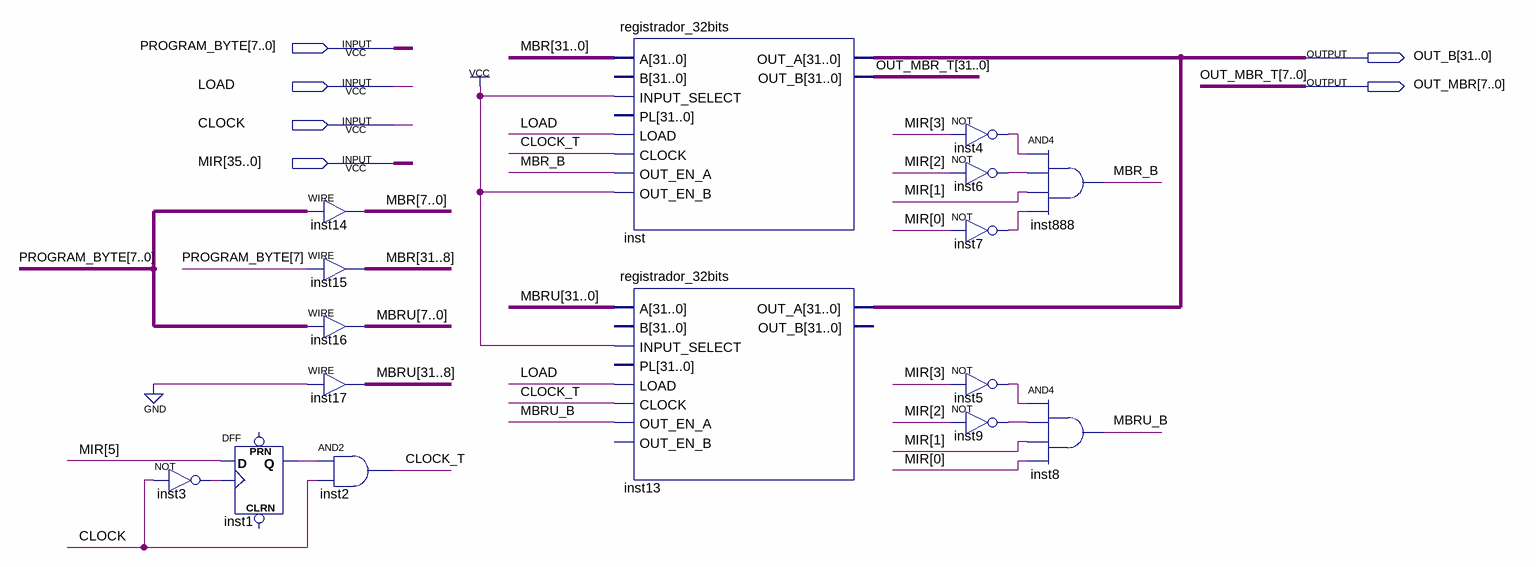
[diagram p0: schematic sheet]
// Quartus schematic MBR.bdf as structural Verilog: 16 symbols, 6 pins
module MBR (
  input  [7:0] PROGRAM_BYTE,
  input  LOAD,
  input  CLOCK,
  input  [35:0] MIR,
  output [31:0] OUT_B,
  output [7:0] OUT_MBR
);

  wire CLOCK_T, inst1_q, inst3_out, inst4_out, inst5_out, inst6_out, inst7_out, inst9_out, MBR_B, MBRU_B;
  wire [31:0] MBR, MBRU;
  wire [31:8] OUT_MBR_T;

  not inst3 (inst3_out, CLOCK);
  DFF inst1 (.CLK(inst3_out), .D(MIR[5]), .Q(inst1_q));  // open: CLRN, PRN
  assign MBR[7:0] = PROGRAM_BYTE;  // WIRE inst14
  assign MBR[31:8] = {24{PROGRAM_BYTE[7]}};  // WIRE inst15
  assign MBRU[7:0] = PROGRAM_BYTE;  // WIRE inst16
  assign MBRU[31:8] = {24{1'b0}};  // WIRE inst17
  and inst2 (CLOCK_T, inst1_q, CLOCK);
  registrador_32bits inst (
    .A(MBR), .INPUT_SELECT(1'b1), .LOAD(LOAD), .CLOCK(CLOCK_T), .OUT_EN_A(MBR_B), .OUT_EN_B(1'b1),
    .OUT_A(OUT_B), .OUT_B({OUT_MBR_T, OUT_MBR}));  // open: B, PL
  registrador_32bits inst13 (
    .A(MBRU), .INPUT_SELECT(1'b1), .LOAD(LOAD), .CLOCK(CLOCK_T), .OUT_EN_A(MBRU_B), .OUT_A(OUT_B));  // open: B, PL, OUT_EN_B, OUT_B
  not inst4 (inst4_out, MIR[3]);
  not inst6 (inst6_out, MIR[2]);
  not inst7 (inst7_out, MIR[0]);
  not inst5 (inst5_out, MIR[3]);
  not inst9 (inst9_out, MIR[2]);
  and inst888 (MBR_B, inst4_out, inst6_out, MIR[1], inst7_out);
  and inst8 (MBRU_B, inst5_out, inst9_out, MIR[1], MIR[0]);

  // Other names for the same wires on the sheet: OUT_MBR_T[7:0] = OUT_MBR
endmodule
